# EAGLE schematic metaboard (EAGLE 5.10)
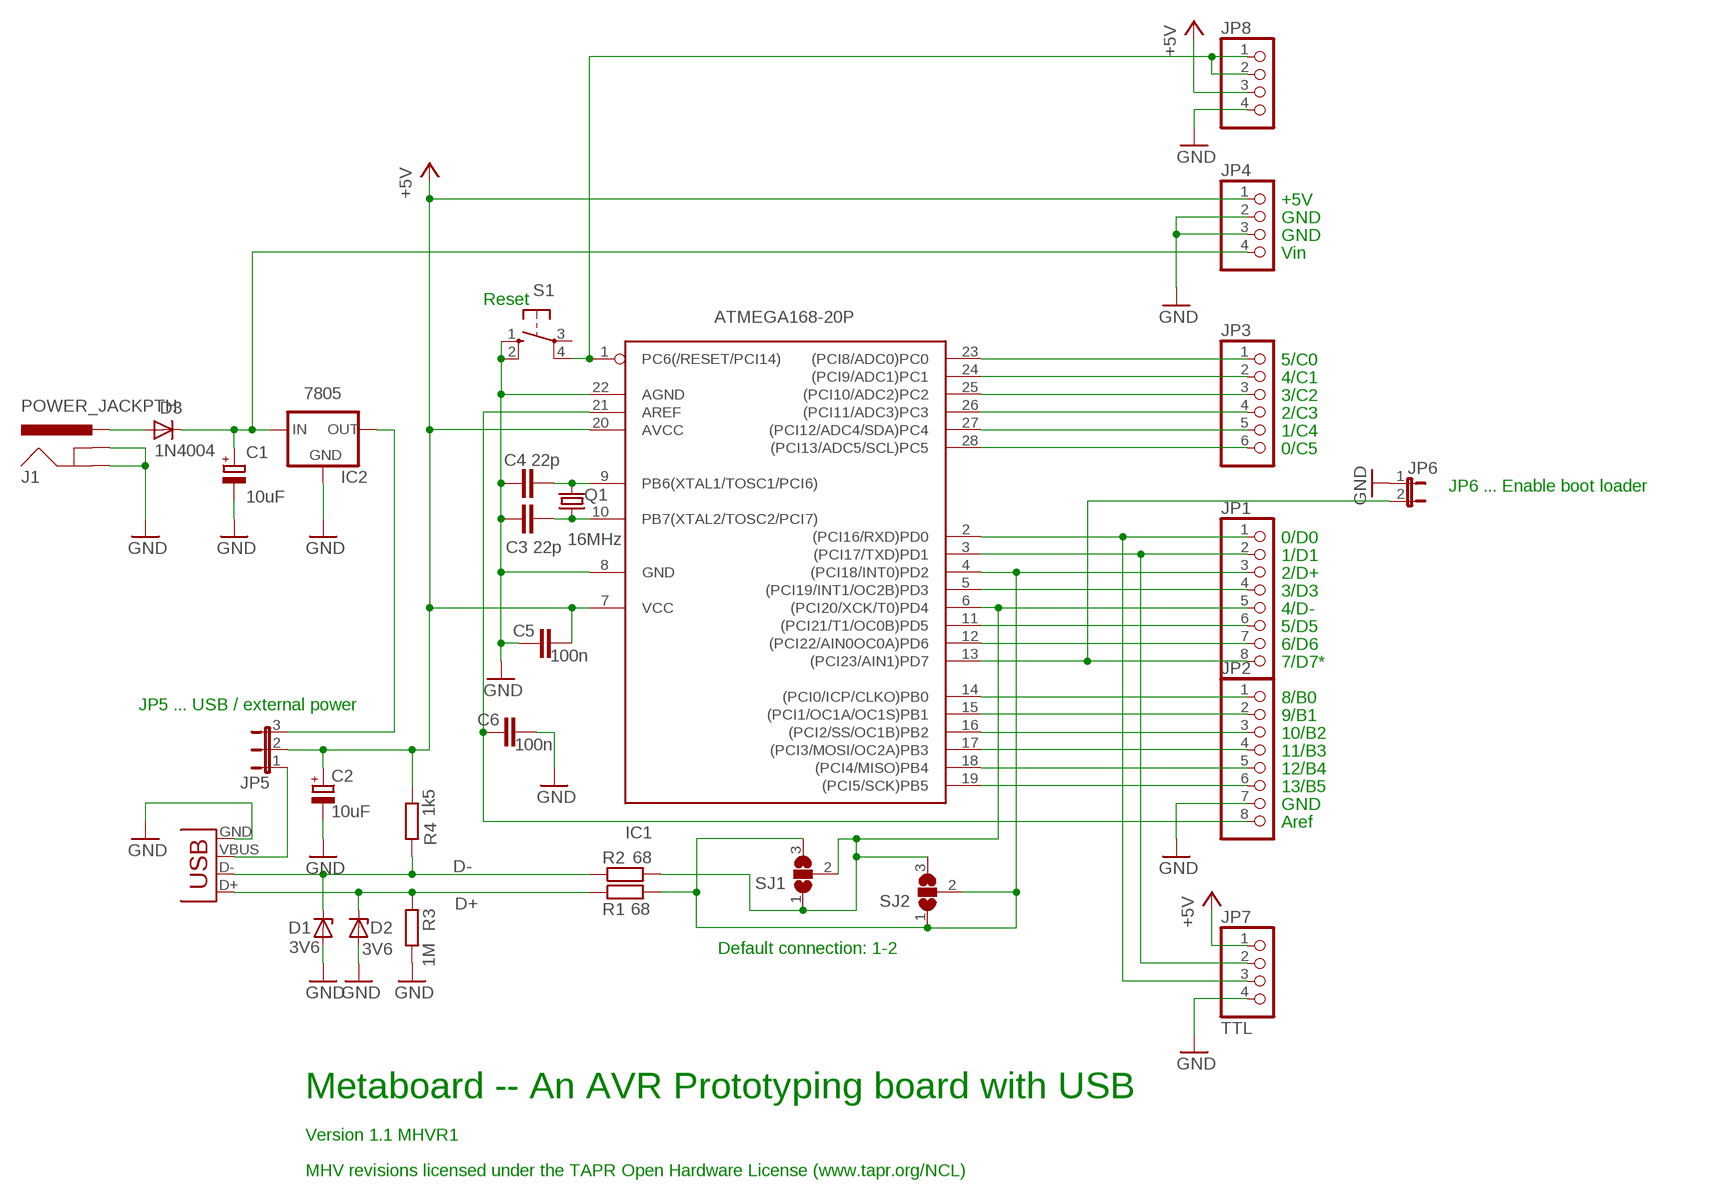
[diagram p0: schematic, sheet 1]

## Parts
C1  10uF  CPOL-EUE2,5-6E  [E2,5-6E]
C2  10uF  CPOL-EUE2,5-6E  [E2,5-6E]
C3  22p  C-EU025-024X044  [C025-024X044]
C4  22p  C-EU025-024X044  [C025-024X044]
C5  100n  C-EU050-024X044  [C050-024X044]
C6  100n  C-EU050-024X044  [C050-024X044]
D1  3V6  ZENER-DIODEDO34-7  [DO34Z7]
D2  3V6  ZENER-DIODEDO34-7  [DO34Z7]
D3  1N4004  [DO41-10]
IC1  ATMEGA168-20P  [DIL28-3]
IC2  7805  78XXL  [78XXL]
J1  POWER_JACKPTH  [POWER_JACK_PTH]
JP1  PINHD-1X8  [1X08]
JP2  PINHD-1X8  [1X08]
JP3  PINHD-1X6  [1X06]
JP4  PINHD-1X4  [1X04]
JP5  JP2E  [JP2]
JP6  JP1E  [JP1]
JP7  TTL  PINHD-1X4  [1X04]
JP8  PINHD-1X4  [1X04]
Q1  16MHz  CRYSTALHC49S  [HC49/S]
R1  68  R-EU_0207/10  [0207/10]
R2  68  R-EU_0207/10  [0207/10]
R3  1M  R-EU_0207/10  [0207/10]
R4  1k5  R-EU_0207/10  [0207/10]
S1  10-XX  [B3F-10XX]
SJ1  SJ2W  [SJ_2]
SJ2  SJ2W  [SJ_2]
X1  USB-MB-H  [USB-MB-H]

## Nets
+5USB: JP5.1 X1.VBUS
+5V: C2.+ C5.2 IC1.7(VCC) IC1.20(AVCC) JP4.1 JP5.2 JP7.1 JP8.3 R4.1
+VRAW: C1.+ D3.C IC2.IN JP4.4
D+: D2.C R1.1 R3.2 X1.D+
D-: D1.C R2.1 R4.2 X1.D-
GND: C1.- C2.- C3.1 C4.1 C5.1 C6.2 D1.A D2.A IC1.8(GND) IC1.22(AGND) IC2.GND J1.GND J1.GNDBREAK JP2.7 JP4.2 JP4.3 JP6.1 JP7.4 JP8.4 R3.1 S1.1(S) S1.2(S1) X1.GND
N$2: IC1.1(PC6(/RESET/PCI14)) JP8.1 JP8.2 S1.4(P1)
N$4: D3.A J1.PWR
N$6: IC1.2((PCI16/RXD)PD0) JP1.1 JP7.3
N$8: IC2.OUT JP5.3
N$9: C3.2 IC1.10(PB7(XTAL2/TOSC2/PCI7)) Q1.1
N$10: C4.2 IC1.9(PB6(XTAL1/TOSC1/PCI6)) Q1.2
N$11: IC1.3((PCI17/TXD)PD1) JP1.2 JP7.2
N$12: IC1.5((PCI19/INT1/OC2B)PD3) JP1.4
N$13: IC1.11((PCI21/T1/OC0B)PD5) JP1.6
N$14: IC1.12((PCI22/AIN0OC0A)PD6) JP1.7
N$15: IC1.13((PCI23/AIN1)PD7) JP1.8 JP6.2
N$16: IC1.23((PCI8/ADC0)PC0) JP3.1
N$17: IC1.24((PCI9/ADC1)PC1) JP3.2
N$18: IC1.25((PCI10/ADC2)PC2) JP3.3
N$19: IC1.26((PCI11/ADC3)PC3) JP3.4
N$20: IC1.27((PCI12/ADC4/SDA)PC4) JP3.5
N$21: IC1.28((PCI13/ADC5/SCL)PC5) JP3.6
N$22: IC1.14((PCI0/ICP/CLKO)PB0) JP2.1
N$23: IC1.15((PCI1/OC1A/OC1S)PB1) JP2.2
N$24: IC1.16((PCI2/SS/OC1B)PB2) JP2.3
N$25: IC1.17((PCI3/MOSI/OC2A)PB3) JP2.4
N$26: IC1.18((PCI4/MISO)PB4) JP2.5
N$27: IC1.19((PCI5/SCK)PB5) JP2.6
N$28: C6.1 IC1.21(AREF) JP2.8
N$189: IC1.4((PCI18/INT0)PD2) JP1.3 R1.2 SJ1.3 SJ2.1 SJ2.2
N$190: IC1.6((PCI20/XCK/T0)PD4) JP1.5 R2.2 SJ1.1 SJ1.2 SJ2.3
Unconnected: S1.3(P)

## Notes on the sheet
- +5V
- GND
- GND
- Vin
- Reset
- 5/C0
- 4/C1
- 3/C2
- 2/C3
- 1/C4
- 0/C5
- JP6 ... Enable boot loader
- 0/D0
- 1/D1
- 2/D+
- 3/D3
- 4/D-
- 5/D5
- 6/D6
- 7/D7*
- 8/B0
- JP5 ... USB / external power
- 9/B1
- 10/B2
- 11/B3
- 12/B4
- 13/B5
- GND
- Aref
- Default connection: 1-2
- Metaboard -- An AVR Prototyping board with USB
- Version 1.1 MHVR1
- MHV revisions licensed under the TAPR Open Hardware License (www.tapr.org/NCL)

## Library data of the parts
C1 C2 = rcl:CPOL-EU: POLARIZED CAPACITOR, European symbol
C3-C6 = rcl:C-EU: CAPACITOR, European symbol
D1 D2 = diode:ZENER-DIODE: Z-Diode
D3 = diode:1N4004: DIODE general purpose rectifier, 1 A
IC1 = avr:ATMEGA168*P: MICROCONTROLLER 16 kBytes FLASH 1 kBytes SRAM 512 Bytes EEPROM USART 8-channel 10 bit ADC
IC2 = v-reg:78XXL: VOLTAGE REGULATOR
J1 = SparkFun:POWER_JACK: Power Jack This is the standard 5.5mm barrel jack for power. The PTH is the most common, proven, reliable, footprint. All others are experimental. The Slot footprint only works if the mill layer is transmitted to the PCB fab house so be warned. Spark Fun Electronics SKU : PRT-00119. Mating wall wart : TOL-00298 (and others)
JP1 JP2 = pinhead:PINHD-1X8: PIN HEADER
JP3 = pinhead:PINHD-1X6: PIN HEADER
JP4 JP7 JP8 = pinhead:PINHD-1X4: PIN HEADER
JP5 = jumper:JP2E: JUMPER
JP6 = jumper:JP1E: JUMPER
Q1 = crystal:CRYSTAL: CRYSTAL
R1-R4 = rcl:R-EU_: RESISTOR, European symbol
S1 = switch-omron:10-XX: OMRON SWITCH
SJ1 SJ2 = jumper:SJ2W: SMD solder JUMPER
X1 = SparkFun:USB: USB Connectors USB-B-PTH is fully proven SKU : PRT-00139 USB-miniB is fully proven SKU : PRT-00587 USB-A-PCB is untested. USB-A-H is throughly reviewed, but untested. Spark Fun Electronics SKU : PRT-00437 USB-B-SMT is throughly reviewed, but untested. Needs silkscreen touching up. USB-A-S has not been used/tested USB-MB-H has not been used/tested